# EAGLE design rapidshark-lipo-sensor-mk-3.6 (EAGLE 7.5.0)
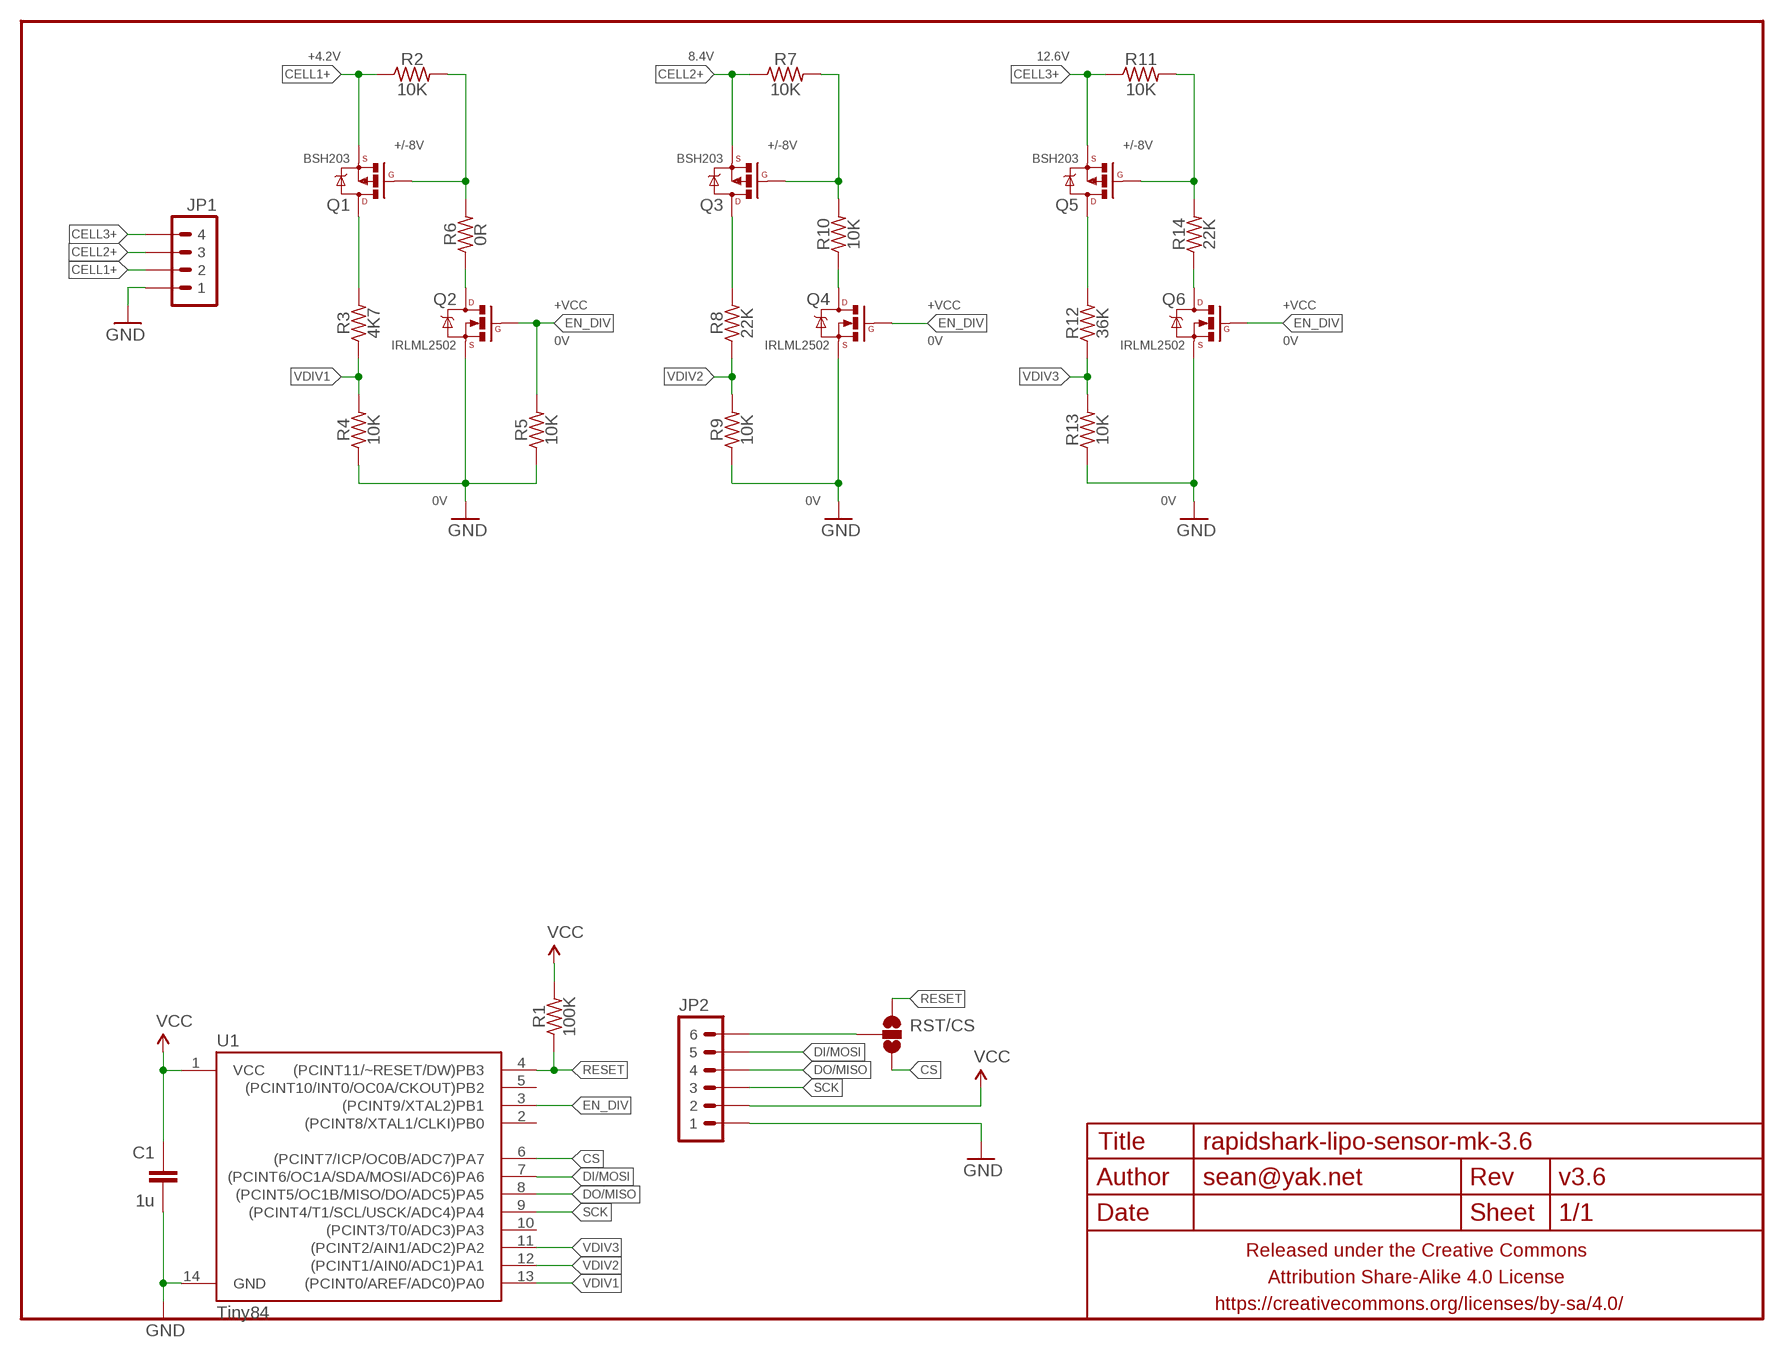
[diagram p0: schematic, sheet 1]

## Parts
C1  1u  CAPACITOR-CERAMICC0603-TIGHTER  [C0603-TIGHTER]
FRAME1  FRAME-LETTERNO_PACKAGE  [DUMMY]
JP1  M04JST_XH_RA  [JST-4-XH-RA-PTH]
JP2  M06PTH_CENTERED  [1X06_CENTERED]
Q1  BSH203  MOSFET-PCHANNELSOT-23  [SOT23]
Q2  IRLML2502  MOSFET-NCHANNELIRLML2502  [SOT23]
Q3  BSH203  MOSFET-PCHANNELSOT-23  [SOT23]
Q4  IRLML2502  MOSFET-NCHANNELIRLML2502  [SOT23]
Q5  BSH203  MOSFET-PCHANNELSOT-23  [SOT23]
Q6  IRLML2502  MOSFET-NCHANNELIRLML2502  [SOT23]
R1  100K  RESISTORR0603-TIGHTER  [R0603-TIGHTER]
R2  10K  RESISTORR0603-TIGHTER  [R0603-TIGHTER]
R3  4K7  RESISTORR0603-TIGHTER  [R0603-TIGHTER]
R4  10K  RESISTORR0603-TIGHTER  [R0603-TIGHTER]
R5  10K  RESISTORR0603-TIGHTER  [R0603-TIGHTER]
R6  0R  RESISTORR0603-TIGHTER  [R0603-TIGHTER]
R7  10K  RESISTORR0603-TIGHTER  [R0603-TIGHTER]
R8  22K  RESISTORR0603-TIGHTER  [R0603-TIGHTER]
R9  10K  RESISTORR0603-TIGHTER  [R0603-TIGHTER]
R10  10K  RESISTORR0603-TIGHTER  [R0603-TIGHTER]
R11  10K  RESISTORR0603-TIGHTER  [R0603-TIGHTER]
R12  36K  RESISTORR0603-TIGHTER  [R0603-TIGHTER]
R13  10K  RESISTORR0603-TIGHTER  [R0603-TIGHTER]
R14  22K  RESISTORR0603-TIGHTER  [R0603-TIGHTER]
RST/CS  JUMPER-PAD-3-NOFULL_BOX_SILK  [PAD-JUMPER-3-NO_YES_SILK_FULL_BOX]
U1  Tiny84  ATTINY84  [SO14]

## Nets
CELL1+: JP1.2 Q1.2(S) R2.1
CELL2+: JP1.3 Q3.2(S) R7.1
CELL3+: JP1.4 Q5.2(S) R11.1
CS: RST/CS.3 U1.6((PCINT7/ICP/OC0B/ADC7)PA7)
DI/MOSI: JP2.5 U1.7((PCINT6/OC1A/SDA/MOSI/ADC6)PA6)
DO/MISO: JP2.4 U1.8((PCINT5/OC1B/MISO/DO/ADC5)PA5)
EN_DIV: Q2.1(G) Q4.1(G) Q6.1(G) R5.2 U1.3((PCINT9/XTAL2)PB1)
GND: C1.2 JP1.1 JP2.1 Q2.2(S) Q4.2(S) Q6.2(S) R4.1 R5.1 R9.1 R13.1 U1.14(GND)
N$1: Q4.3(D) R10.1
N$2: Q3.3(D) R8.2
N$3: Q5.3(D) R12.2
N$4: Q1.1(G) R2.2 R6.2
N$5: Q3.1(G) R7.2 R10.2
N$6: Q1.3(D) R3.2
N$7: Q5.1(G) R11.2 R14.2
N$8: Q6.3(D) R14.1
N$9: Q2.3(D) R6.1
RESET: R1.1 RST/CS.1 U1.4((PCINT11/~RESET/DW)PB3)
RST/CS: JP2.6 RST/CS.2
SCK: JP2.3 U1.9((PCINT4/T1/SCL/USCK/ADC4)PA4)
VCC: C1.1 JP2.2 R1.2 U1.1(VCC)
VDIV1: R3.1 R4.2 U1.13((PCINT0/AREF/ADC0)PA0)
VDIV2: R8.1 R9.2 U1.12((PCINT1/AIN0/ADC1)PA1)
VDIV3: R12.1 R13.2 U1.11((PCINT2/AIN1/ADC2)PA2)
Unconnected: U1.2((PCINT8/XTAL1/CLKI)PB0) U1.5((PCINT10/INT0/OC0A/CKOUT)PB2) U1.10((PCINT3/T0/ADC3)PA3)

## Notes on the sheet
- +4.2V | 8.4V | 12.6V
- +/-8V | +/-8V | +/-8V
- +VCC | +VCC | +VCC
- 0V | 0V | 0V
- 0V | 0V | 0V

## Library data of the parts
C1 = a_parts:CAPACITOR-CERAMIC: CAPACITOR, European symbol
FRAME1 = A_butts:FRAME-LETTER: Schematic Frame Standard 8.5x11 US Letter frame; DESIGNER: sean@yak.net; VERSION: v3.6
JP1 = a_parts:M04: Header 4 Standard 4-pin 0.1" header. Use with straight break away headers (SKU : PRT-00116), right angle break away headers (PRT-00553), swiss pins (PRT-00743), machine pins (PRT-00117), and female headers (PRT-00115). Molex polarized connector foot print use with SKU : PRT-08231 with associated crimp pins and housings. 1MM SMD Version SKU: PRT-10208
JP2 = a_parts:M06: Header 6 Standard 6-pin 0.1" header. Use with straight break away headers (SKU : PRT-00116), right angle break away headers (PRT-00553), swiss pins (PRT-00743), machine pins (PRT-00117), and female headers (PRT-00115). Molex polarized connector foot print use with SKU : PRT-08094 with associated crimp pins and housings. NOTES ON THE VARIANTS LOCK and LOCK_LONGPADS... This footprint was designed to help hold the alignment of a through-hole component (i.e. 6-pin header) while soldering it into place. You may notice that each hole has been shifted either up or down by 0.005 of an inch from it's more standard position (which is a perfectly straight line). This slight alteration caused the pins (the squares in the middle) to touch the edges of the holes. Because they are alternating, it causes a "brace" to hold the component in place. 0.005 has proven to be the perfect amount of "off-center" position when using our standard breakaway headers. Although looks a little odd when you look at the bare footprint, once you have a header in there, the alteration is very hard to notice. Also,if you push a header all the way into place, it is covered up entirely on the bottom side. This idea of altering the position of holes to aid alignment will be further integrated into the Sparkfun Library for other footprints. It can help hold any component with 3 or more connection pins.
Q1 Q3 Q5 = a_parts:MOSFET-PCHANNEL: Generic PMOSFET IRLML2244 - TRANS-11153 (SOT-23 -20V -4.3A) (1.Gate 2.Source 3.Drain) FQP27P06 - COM-10349 <http://www.sparkfun.com/products/10349> (TO-220 -60V -27A) (1.Gate 2.Source 3.Drain)
Q2 Q4 Q6 = a_parts:MOSFET-NCHANNEL: Common NMOSFET Parts MFG P/N Store ID Prod ID FDD8780 TRANS-09984 SI7820DN TRANS-11055 FDS6630A IC-08089 2N7002PW TRANS-11151 FQP30N06L COM-10213 TRANS-10060 BSS123LT1G TRANS-08345 BSS138 TRANS-00830 BS170 2N7000
R1-R14 = a_parts:RESISTOR: RESISTOR, American symbol
RST/CS = a_parts:JUMPER-PAD-3-NO
U1 = A_butts:ATTINY84: Atmel 14-pin 2/4/8kB flash uC

## Board
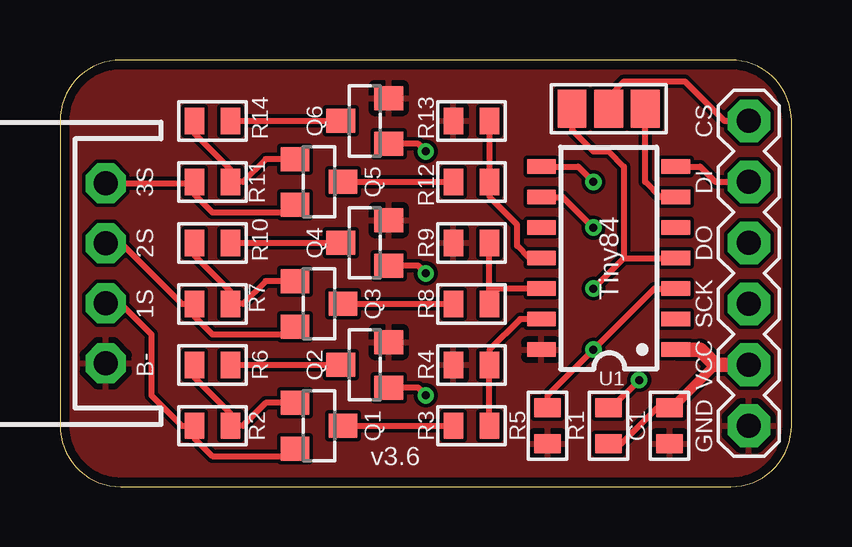
[diagram p1: board, top side]
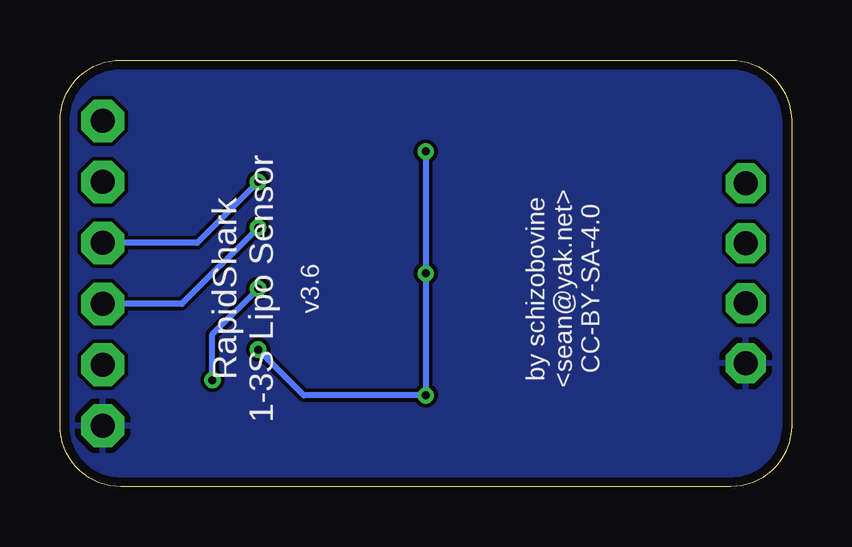
[diagram p2: board, bottom side, seen from below]

Size 30.48 x 17.78 mm. Coordinates in mm from the lower left corner, seen from the top.
Outline: 0,15.24 0,2.54 arc90 2.54,0 27.94,0 arc90 30.48,2.54 30.48,15.24 arc90 27.94,17.78 2.54,17.78 arc90 0,15.24
Copper layers (1*16): Top 0.0356mm / dielectric 1.5011mm / Bottom 0.0356mm
Design rules "LaenPCBOrder2": minimum track width 6mil, minimum drill 13mil, track to track 6mil, track to pad 6mil, pad to pad 6mil, via to via 6mil, smd to smd 6mil, copper to edge 15mil, drill to drill 6mil, minimum pad ring 7mil, minimum via ring 7mil, stop-mask expansion 3mil, vias tented up to drill 20mil, thermal gap 10mil

### Footprints (pad centres in the part's own frame; a part is rotated, then mirrored left to right if it is on the bottom)
C0603-TIGHTER = smd 0.8 x 1.1: 1 -0.75,0; 2 0.75,0
JST-4-XH-RA-PTH = drill 1 pad 1.676 octagon: 1 -3.75,0; 2 -1.25,0; 3 1.25,0; 4 3.75,0
1X06_CENTERED = drill 1 pad 1.778 octagon: 1 -6.35,0; 2 -3.81,0; 3 -1.27,0; 4 1.27,0; 5 3.81,0; 6 6.35,0
SOT23 = smd 1 x 1.2: 1 -0.95,-1; 2 0.95,-1; 3 0,1
R0603-TIGHTER = smd 0.8 x 1.1: 1 -0.75,0; 2 0.75,0
PAD-JUMPER-3-NO_YES_SILK_FULL_BOX = smd 1.2 x 1.6: 1 -1.524,0; 2 0,0; 3 1.524,0
SO14 = smd 0.6 x 1.2: 1 -3.81,-2.8; 2 -2.54,-2.8; 3 -1.27,-2.8; 4 0,-2.8; 5 1.27,-2.8; 6 2.54,-2.8; 7 3.81,-2.8; 8 3.81,2.8; 9 2.54,2.8; 10 1.27,2.8; 11 0,2.8; 12 -1.27,2.8; 13 -2.54,2.8; 14 -3.81,2.8

### Placement (x,y rotation side)
C1  25.4,2.54 270 top
FRAME1  0,0 0 top
JP1  1.91,8.89 90 top
JP2  28.7,8.89 90 top
Q1  10.79,2.54 270 top
Q2  12.7,5.08 90 top
Q3  10.79,7.62 270 top
Q4  12.7,10.16 90 top
Q5  10.79,12.7 270 top
Q6  12.7,15.24 90 top
R1  22.86,2.54 270 top
R2  6.35,2.54 0 top
R3  17.14,2.54 180 top
R4  17.14,5.08 0 top
R5  20.32,2.54 90 top
R6  6.35,5.08 180 top
R7  6.35,7.62 0 top
R8  17.14,7.62 180 top
R9  17.14,10.16 0 top
R10  6.35,10.16 180 top
R11  6.35,12.7 0 top
R12  17.14,12.7 180 top
R13  17.14,15.24 0 top
R14  6.35,15.24 180 top
RST/CS  22.86,15.75 0 top
U1  22.86,9.53 90 top

### Tracks (layer width: path | path; a pad name or v marks a point on that pad's centre or on a via)
CELL1+
  Top 0.254: JP1.2 2.52,7.64 3.81,6.35 3.81,3.81 5.08,2.54 R2.1 5.6,2.02 6.35,1.27 9.47,1.27 Q1.2
CELL2+
  Top 0.254: JP1.3 2.56,10.14 5.08,7.62 R7.1 5.6,7.1 6.35,6.35 9.47,6.35 Q3.2
CELL3+
  Top 0.254: JP1.4 5.54,12.64 R11.1 5.6,12.18 6.35,11.43 9.47,11.43 Q5.2
CS
  Top 0.254: U1.6 25.02,12.06 24.38,12.7 RST/CS.3
DI/MOSI
  Top 0.254: U1.7 26.67,13.34 27.3,12.7 JP2.5
DO/MISO  (via drill 0.33)
  Top 0.254: U1.8 21.59,13.34 v22.23,12.7
  Bottom 0.254: v22.23,12.7 24.77,10.16 JP2.4
EN_DIV  (via drill 0.33)
  Top 0.254: v15.24,8.89 14.92,9.21 Q4.1 | v15.24,13.97 14.92,14.29 Q6.1 | v15.24,3.81 14.92,4.13 Q2.1 | U1.3 24.77,8.26 v22.23,5.71 20.32,3.81 R5.2
  Bottom 0.254: v22.23,5.71 20.32,3.81 v15.24,3.81 v15.24,8.89 v15.24,13.97
GND
  pour Bottom: 30.48,15.24 30.48,2.54 arc-90 27.94,0 2.54,0 arc-90 0,2.54 0,15.24 arc-90 2.54,17.78 27.94,17.78 arc-90
  pour Top: 30.48,15.24 30.48,2.54 arc-90 27.94,0 2.54,0 arc-90 0,2.54 0,15.24 arc-90 2.54,17.78 27.94,17.78 arc-90
N$1
  Top 0.254: R10.1 Q4.3
N$2
  Top 0.254: Q3.3 R8.2
N$3
  Top 0.254: Q5.3 R12.2
N$4
  Top 0.254: R6.2 5.6,4.56 7.1,3.06 R2.2 7.62,2.54 8.57,3.49 Q1.1
N$5
  Top 0.254: R10.2 5.6,9.64 7.1,8.14 R7.2 7.62,7.62 8.57,8.57 Q3.1
N$6
  Top 0.254: Q1.3 R3.2
N$7
  Top 0.254: R14.2 5.6,14.72 7.1,13.22 R11.2 7.62,12.7 8.57,13.65 Q5.1
N$8
  Top 0.254: R14.1 Q6.3
N$9
  Top 0.254: R6.1 Q2.3
RESET  (via drill 0.33)
  Top 0.254: R1.1 22.98,3.29 v24.13,4.45 | v22.23,8.26 23.5,9.53 | 23.5,9.53 U1.4 | RST/CS.1 21.34,14.86 22.23,13.97 22.86,13.97 23.5,13.34 23.5,9.53
  Bottom 0.254: v24.13,4.45 24.13,6.35 v22.23,8.26
RST/CS
  Top 0.254: RST/CS.2 22.86,16.26 23.5,16.89 26.04,16.89 27.69,15.24 JP2.6
SCK  (via drill 0.33)
  Top 0.254: U1.9 20.95,12.06 v22.23,10.79
  Bottom 0.254: v22.23,10.79 25.4,7.62 JP2.3
VCC
  Top 0.254: C1.1 24.88,3.29 23.38,1.79 R1.2
  Top 0.406: C1.1 25.52,3.29 27.3,5.08
  Top 0.61: U1.1 26.67,5.71 27.3,5.08 JP2.2
VDIV1
  Top 0.254: U1.13 19.18,6.99 17.89,5.7 R4.2 R3.1
VDIV2
  Top 0.254: R8.1 17.89,8.26 | 17.89,8.26 R9.2 | U1.12 17.89,8.26
VDIV3
  Top 0.254: U1.11 19.56,9.53 19.05,10.03 19.05,10.92 17.91,12.06 17.91,12.69 R12.1 | R12.1 17.89,12.59 | R13.2 R12.1

### Text on the board
tPlace: CS | 3S | DI | 2S | DO | 1S | SCK | B- | VCC | GND
bPlace: by schizobovine / <sean@yak.net> / CC-BY-SA-4.0 | RapidShark / 1-3S Lipo Sensor